# Altium project Capstone_Signal_Conditioners.PrjPcb
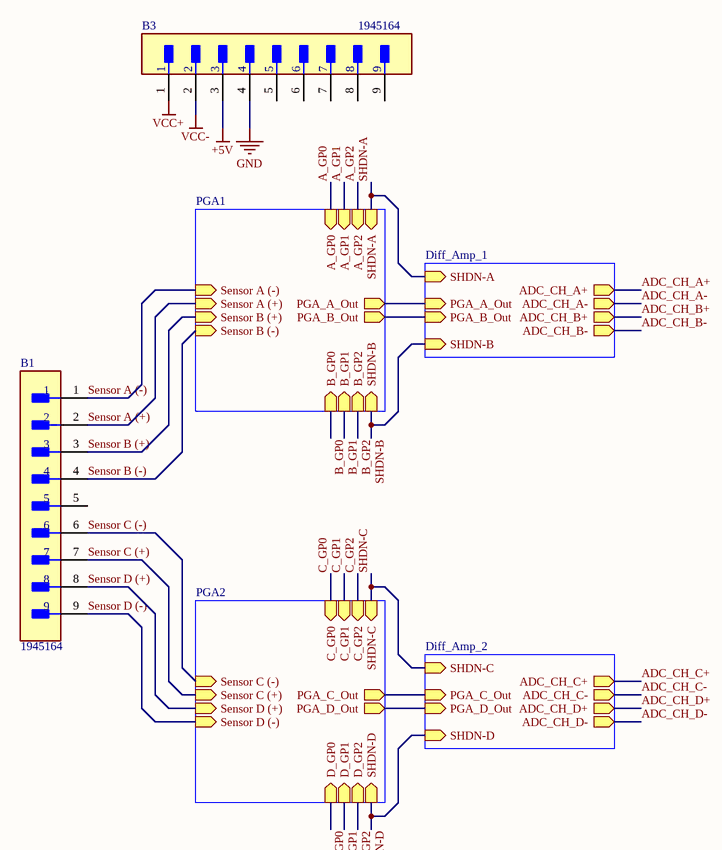
[diagram p0: Capstone_Signal_Conditioners_Subsystem_Test_Schematic.SchDoc]
4 sheets, 44 parts. Net scope: hierarchical (ports join the sheet entries above them; power ports are global).
Board file: Capstone_Signal_Conditioning_Subsystem_Test_PCB.PcbDoc
Sheets:
  Capstone_Signal_Conditioners_Subsystem_Test_Schematic.SchDoc
    PGA1 = THS7002CPWP_Schematic.SchDoc
    PGA2 = THS7002CPWP_Schematic_2.SchDoc
    Diff_Amp_2 = LTC6362_Schematic_2.SchDoc

## Sheet Capstone_Signal_Conditioners_Subsystem_Test_Schematic.SchDoc
size A; SheetNumber: 1; SheetTotal: 5

### Parts
B1  1945164  [FP-4-644456-0-MFG]
B3  1945164  [FP-4-644456-0-MFG]

### Sub-sheets
Diff_Amp_1 = LTC6362_Schematic.SchDoc (file not in this document): PGA_A_Out (in), PGA_B_Out (in), SHDN-A (in), SHDN-B (in), ADC_CH_A+ (out), ADC_CH_A- (out), ADC_CH_B- (out), ADC_CH_B+ (out)
Diff_Amp_2 = LTC6362_Schematic_2.SchDoc: SHDN-C (in), SHDN-D (in), ADC_CH_D- (out), ADC_CH_D+ (out), ADC_CH_C- (out), ADC_CH_C+ (out), PGA_C_Out (in), PGA_D_Out (in)
PGA1 = THS7002CPWP_Schematic.SchDoc: Sensor A (+) (in), Sensor A (-) (in), Sensor B (+) (in), Sensor B (-) (in), A_GP0 (in), A_GP1 (in), A_GP2 (in), PGA_A_Out (out), PGA_B_Out (out), B_GP0 (in), B_GP1 (in), B_GP2 (in), SHDN-A (in), SHDN-B (in)
PGA2 = THS7002CPWP_Schematic_2.SchDoc: Sensor C (+) (in), Sensor C (-) (in), Sensor D (+) (in), Sensor D (-) (in), C_GP0 (in), D_GP0 (in), C_GP1 (in), C_GP2 (in), D_GP1 (in), D_GP2 (in), SHDN-C (in), SHDN-D (in), PGA_C_Out (out), PGA_D_Out (out)

### Nets
+5V: B3.3
GND: B3.4
VCC+: B3.1
VCC-: B3.2
ADC_CH_A+: sheet Diff_Amp_1/ADC_CH_A+
ADC_CH_A-: sheet Diff_Amp_1/ADC_CH_A-
ADC_CH_B+: sheet Diff_Amp_1/ADC_CH_B+
ADC_CH_B-: sheet Diff_Amp_1/ADC_CH_B-
PGA_A_Out: sheet PGA1/PGA_A_Out, sheet Diff_Amp_1/PGA_A_Out
PGA_B_Out: sheet PGA1/PGA_B_Out, sheet Diff_Amp_1/PGA_B_Out
PGA_C_Out: sheet PGA2/PGA_C_Out, sheet Diff_Amp_2/PGA_C_Out
PGA_D_Out: sheet PGA2/PGA_D_Out, sheet Diff_Amp_2/PGA_D_Out
Sensor A (+): B1.2 ; sheet PGA1/Sensor A (+)
Sensor A (-): B1.1 ; sheet PGA1/Sensor A (-)
Sensor B (+): B1.3 ; sheet PGA1/Sensor B (+)
Sensor B (-): B1.4 ; sheet PGA1/Sensor B (-)
Sensor C (+): B1.7 ; sheet PGA2/Sensor C (+)
Sensor C (-): B1.6 ; sheet PGA2/Sensor C (-)
Sensor D (+): B1.8 ; sheet PGA2/Sensor D (+)
Sensor D (-): B1.9 ; sheet PGA2/Sensor D (-)
SHDN-A: sheet PGA1/SHDN-A, sheet Diff_Amp_1/SHDN-A
SHDN-B: sheet PGA1/SHDN-B, sheet Diff_Amp_1/SHDN-B
SHDN-C: sheet PGA2/SHDN-C, sheet Diff_Amp_2/SHDN-C
SHDN-D: sheet PGA2/SHDN-D, sheet Diff_Amp_2/SHDN-D

Not connected (* = marked no-connect by the designer): B1 5; B3 5 6 7 8 9

### Library data of the parts
B1 B3 = CMP-03369-000038-1: CONN HEADER VERT 9POS 3.5MM; Manufacturer Part Number: 4-644456-0; Manufacturer: TE Connectivity; Pitch: 2.54mm; Current Rating: 5A; Conn Gender: Male; Number Of Contacts: 10; Conn Orientation: Vertical; Voltage Rating: 250V; Number Of Rows: 1; Device Class L3: unset; Octopart: https://octopart.com/4-644456-0-te+connectivity-39514173; Mouser Description: Headers & Wire Housings NARROW FLT HDR 10P Straight Post; ComponentLink2Description: Datasheet; Height: 0.408inch; Package: 4-644456-0; RoHS: TRUE; Temperature Range High: +105°C; Digikey Description: CONN HEADER VERT 10POS 2.54MM; Temperature: -55°C to +105°C; Device Class L2: Headers and Wire Housings; Automotive: No; Lead Free: Yes; Contact Material: Tin; Temperature Range Low: -55°C; Footprint Url: https://www.te.com/commerce/DocumentDelivery/DDEController?Action=showdoc&DocId=Customer+Drawing%7F644456%7FD2%7Fpdf%7FEnglish%7FENG_CD_644456_D2.pdf%7F4-644456-0; Device Class L1: Connectors; Category: Conn; ComponentLink2URL: https://www.te.com/commerce/DocumentDelivery/DDEController?Action=showdoc&DocId=Data+Sheet%7F82056_MTA%7F0818%7Fpdf%7FEnglish%7FENG_DS_82056_MTA_0818.pdf%7F4-644456-0

## Sheet THS7002CPWP_Schematic.SchDoc
size A; SheetNumber: 2; SheetTotal: 4
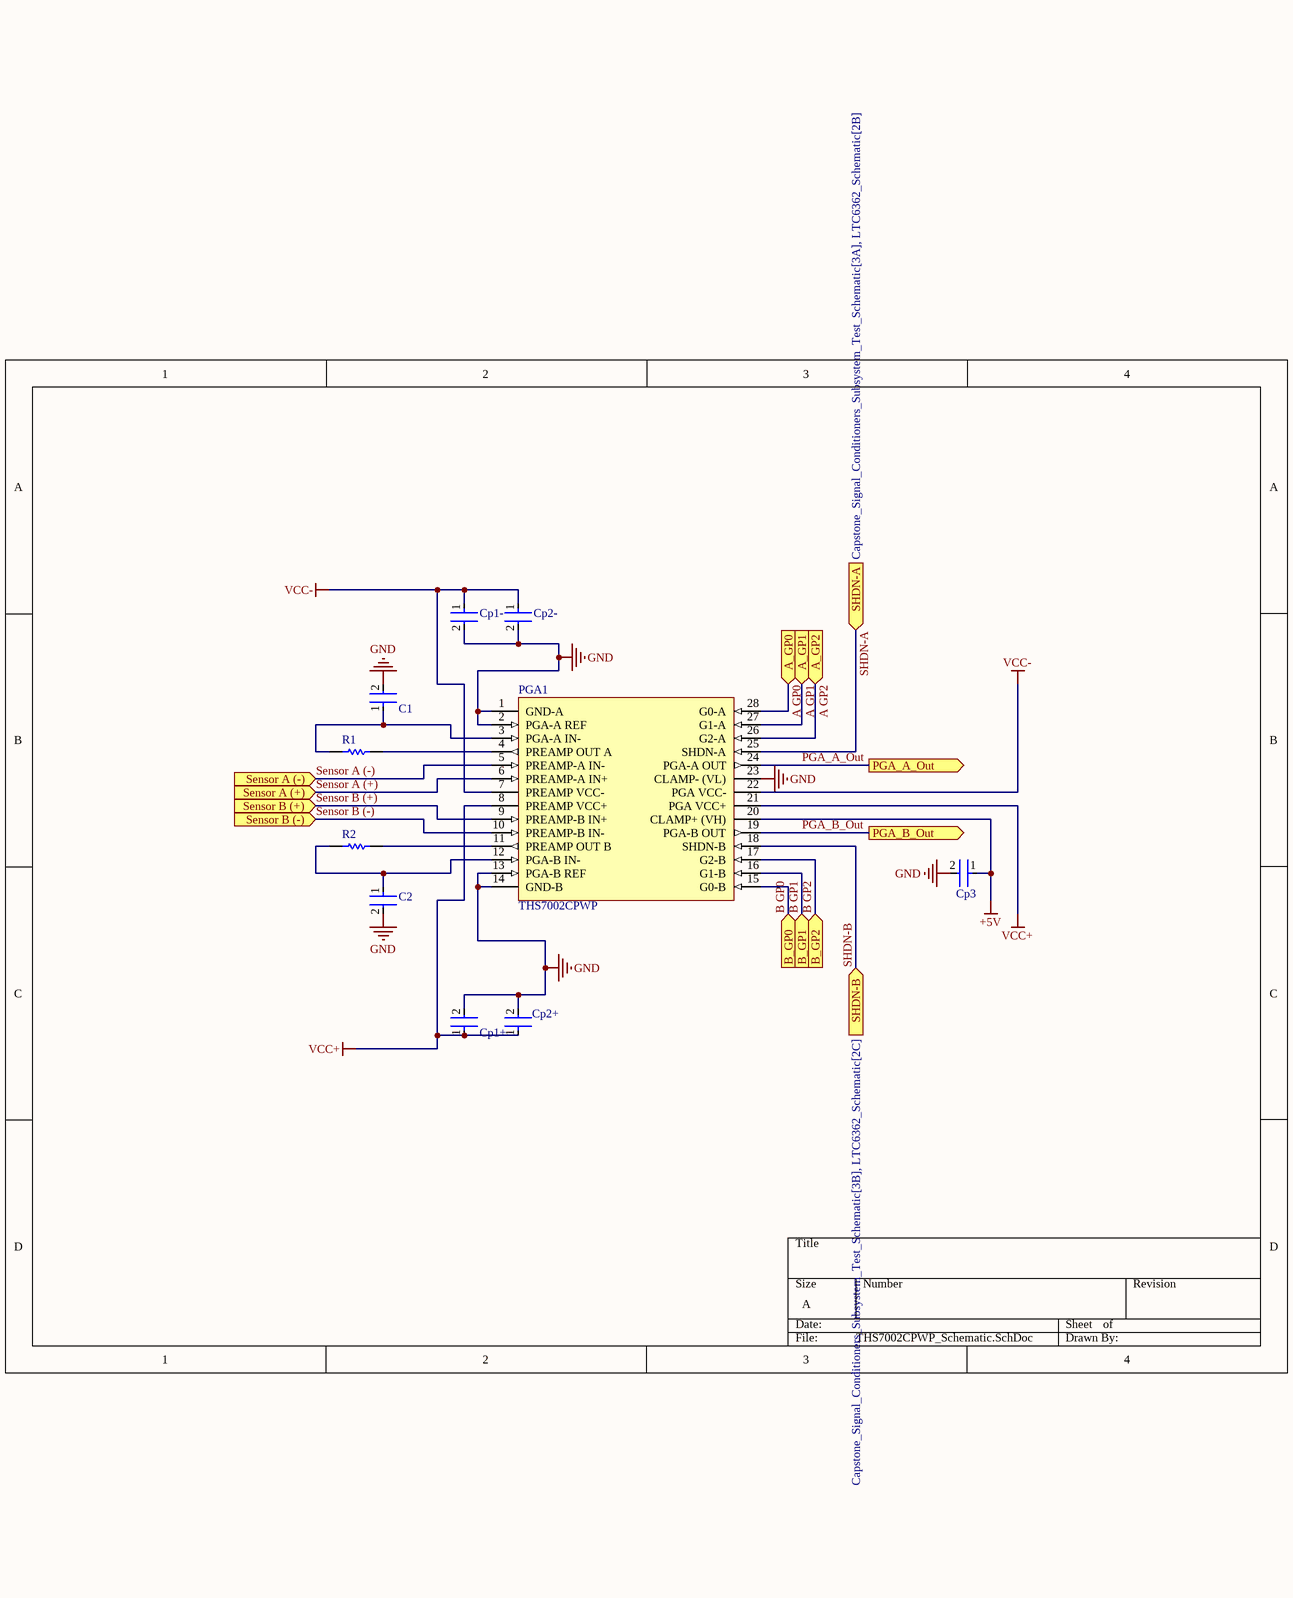
[diagram p1: THS7002CPWP_Schematic.SchDoc]

### Parts
C1  GRM3195C1H163JA01D  [FP-GRM319-0_15-IPC_A]  (value not drawn)
C2  GRM3195C1H163JA01D  [FP-GRM319-0_15-IPC_A]  (value not drawn)
Cp1+  CC0603KRX7R7BB104  [FP-CC0603-DA-MFG]  (value not drawn)
Cp1-  CC0603KRX7R7BB104  [FP-CC0603-DA-MFG]  (value not drawn)
Cp2+  C2012JB1A685K060AC  [FP-C2012-060-0_2-IPC_A]  (value not drawn)
Cp2-  C2012JB1A685K060AC  [FP-C2012-060-0_2-IPC_A]  (value not drawn)
Cp3  C2012JB1A685K060AC  [FP-C2012-060-0_2-IPC_A]  (value not drawn)
PGA1  THS7002CPWP  [PWP0028E_M]
R1  CRCW08050000Z0EA  [RESC2013X50X30LL20T20]  (value not drawn)
R2  CRCW08050000Z0EA  [RESC2013X50X30LL20T20]  (value not drawn)

### Ports
A_GP0 (in, see Capstone_Signal_Conditioners_Subsystem_Test_Schematic[2A]), A_GP1 (in, see Capstone_Signal_Conditioners_Subsystem_Test_Schematic[2A]), A_GP2 (in, see Capstone_Signal_Conditioners_Subsystem_Test_Schematic[3A]), B_GP0 (in, see Capstone_Signal_Conditioners_Subsystem_Test_Schematic[2B]), B_GP1 (in, see Capstone_Signal_Conditioners_Subsystem_Test_Schematic[2B]), B_GP2 (in, see Capstone_Signal_Conditioners_Subsystem_Test_Schematic[3B]), PGA_A_Out (out, see Capstone_Signal_Conditioners_Subsystem_Test_Schematic[3B], LTC6362_Schematic[1B]), PGA_B_Out (out, see Capstone_Signal_Conditioners_Subsystem_Test_Schematic[3B], LTC6362_Schematic[1B]), Sensor A (+) (in, see Capstone_Signal_Conditioners_Subsystem_Test_Schematic[2B]), Sensor A (-) (in, see Capstone_Signal_Conditioners_Subsystem_Test_Schematic[2B]), Sensor B (+) (in, see Capstone_Signal_Conditioners_Subsystem_Test_Schematic[2B]), Sensor B (-) (in, see Capstone_Signal_Conditioners_Subsystem_Test_Schematic[2B]), SHDN-A (in, see Capstone_Signal_Conditioners_Subsystem_Test_Schematic[3A], LTC6362_Schematic[2B]), SHDN-B (in, see Capstone_Signal_Conditioners_Subsystem_Test_Schematic[3B], LTC6362_Schematic[2C])

### Nets
+5V: Cp3.1 PGA1.20(CLAMP+_(VH))
GND: C1.2 C2.2 Cp1+.2 Cp1-.2 Cp2+.2 Cp2-.2 Cp3.2 PGA1.1(GND-A) PGA1.2(PGA-A_REF) PGA1.13(PGA-B_REF) PGA1.14(GND-B) PGA1.23(CLAMP-_(VL))
VCC+: Cp1+.1 Cp2+.1 PGA1.8(PREAMP_VCC+) PGA1.21(PGA_VCC+)
VCC-: Cp1-.1 Cp2-.1 PGA1.7(PREAMP_VCC-) PGA1.22(PGA_VCC-)
A GP0: PGA1.28(G0-A) ; port A_GP0
A GP1: PGA1.27(G1-A) ; port A_GP1
A GP2: PGA1.26(G2-A) ; port A_GP2
B GP0: PGA1.15(G0-B) ; port B_GP0
B GP1: PGA1.16(G1-B) ; port B_GP1
B GP2: PGA1.17(G2-B) ; port B_GP2
PGA_A_Out: PGA1.24(PGA-A_OUT) ; port PGA_A_Out
PGA_B_Out: PGA1.19(PGA-B_OUT) ; port PGA_B_Out
Sensor A (+): PGA1.6(PREAMP-A_IN+) ; port Sensor A (+)
Sensor A (-): PGA1.5(PREAMP-A_IN-) ; port Sensor A (-)
Sensor B (+): PGA1.9(PREAMP-B_IN+) ; port Sensor B (+)
Sensor B (-): PGA1.10(PREAMP-B_IN-) ; port Sensor B (-)
SHDN-A: PGA1.25(SHDN-A) ; port SHDN-A
SHDN-B: PGA1.18(SHDN-B) ; port SHDN-B
NetC1_1: C1.1 PGA1.3(PGA-A_IN-) R1.1
NetC2_1: C2.1 PGA1.12(PGA-B_IN-) R2.1
NetPGA1_4: PGA1.4(PREAMP_OUT_A) R1.2
NetPGA1_11: PGA1.11(PREAMP_OUT_B) R2.2

### Library data of the parts
C1 C2 = CMP-06035-007665-1: Chip Multilayer Ceramic Capacitors for General Purpose, 1206, 16000pF, C0G, 30ppm/°C, 5%, 50V; Capacitance: 16nF; Tolerance: 5%; Case Code (Metric): 3216; Length: 3.2mm; Package Quantity: 4000; Mount: Surface Mount; Voltage Rating (DC): 50V; Voltage Rating: 50V; Case Code (Imperial): 1206; Height: 0.85mm; Min Operating Temperature: -55°C; Max Operating Temperature: 125°C; Termination: SMD/SMT; Width: 0.063inch; Radiation Hardening: No; Depth: 1.6mm; Thickness: 0.037inch; Dielectric: C0G; Case/Package: 1206; Packaging: Tape and Reel
Cp1+ Cp1- = CMP-2000-05002-2: CAP CER 0.1UF 16V X7R 0603; Manufacturer: YAGEO; Tolerance: 0.1; Value: 100 nF; Temperature Coefficient: 15%; Description: CC0603 100 nF X7R 10.00% 16 V; Voltage Rating: 16 V; Package: CC0603-DA; ComponentLink2Description: Datasheet; Octopart: https://octopart.com/cc0603krx7r7bb104-yageo-192941; Temperature Range High: +125°C; Digikey Description: CAP CER 0.1UF 16V X7R 0603; Voltage: 16 V; Device Class L2: Capacitors; Height: 0.9mm; Temperature: -55°C to +125°C; Manufacturer Part Number: CC0603KRX7R7BB104; Device Class L1: Passive Components; Device Class L3: Ceramic Capacitors; ComponentLink2URL: http://www.yageo.com/documents/recent/UPY-GPHC_X7R_6.3V-to-50V_18.pdf; Footprint Url: http://www.yageo.com/exep/pages/download/literatures/UPY-C_GEN_24.pdf; RoHS: TRUE; Temperature Range Low: -55°C; Temperature Characteristic: X7R; Lead Free: Yes; Capacitance: 100 nF; Category: Cap; Mouser Description: Multilayer Ceramic Capacitor, CC Series, 0.1 - F, - 10%, X7R, 16 V, 0603 [1608 Metric]; Material: Ceramic; Automotive: No
Cp2+ Cp2- Cp3 = CMP-08246-004641-1: Multilayer Ceramic Capacitors 6.8μF ±10% 10V JB SMD 0805; Capacitance: 6.8uF; RoHS Compliant: Yes; Case Code (Metric): 5032; Case/Package: 0805; Voltage Rating: 10V; Width: 0.049inch; Min Operating Temperature: -25°C; Mount: Surface Mount; Voltage Rating (DC): 10V; Dielectric Material: Ceramic; Case Code (Imperial): 2012; Package Quantity: 4000; Lead Free: Lead Free; Packaging: Tape and Reel; Length: 0.079inch; Tolerance: 10%; Thickness: 0.028inch; Max Operating Temperature: 85°C; Series: C
PGA1 = CMP-0988-00132-2: 70-MHz High-Speed Programmable-Gain Amplifier, Dual, 0 to 70 degC, 28-pin SOP (PWP28), Green (RoHS & no Sb/Br); Manufacturer: Texas Instruments; Disable: TRUE; BW @ Acl(MHz): 100; Vs(Min)(V): 9; Vs(Max)(V): 32; Number of Channels: 2; Vio(Max)(mV): 7; Iib(Max)(nA): 6000; SubFamily: Variable Gain Amplifier; Vn at Flatband(Typ)(nV/rtHz): 1.7; Slew Rate(Typ)(V/us): 85; ComponentLink1Description: Manufacturer URL; Code_JEDEC: MO-153; PackageVersion: 4073225-6/I, 05/2011; PackageReference: PWP0028E; Eco-Plan: Green (RoHS & no Sb/Br); ComponentLink2URL: http://www.ti.com/general/docs/lit/getliterature.tsp?genericPartNumber=THS7002&fileType=pdf; PackageDescription: 28-Pin Plastic Small Outline, Body 4.4 x 9.7 mm, Pitch 0.65 mm; DatasheetVersion: SLOS214C; ComponentLink3URL: http://www.ti.com/litv/pdf/mpds373; ComponentLink3Description: Package Specification; ComponentLink1URL: http://www.ti.com/; ComponentLink2Description: Datasheet; Mounting Technology: Surface Mount; PartNumber: THS7002CPWP
R1 R2 = CMP-2001-04896-1: Manufacturer: Vishay Dale; Part Number: CRCW08050000Z0EA

## Sheet THS7002CPWP_Schematic_2.SchDoc
size A; SheetNumber: 4; SheetTotal: 4
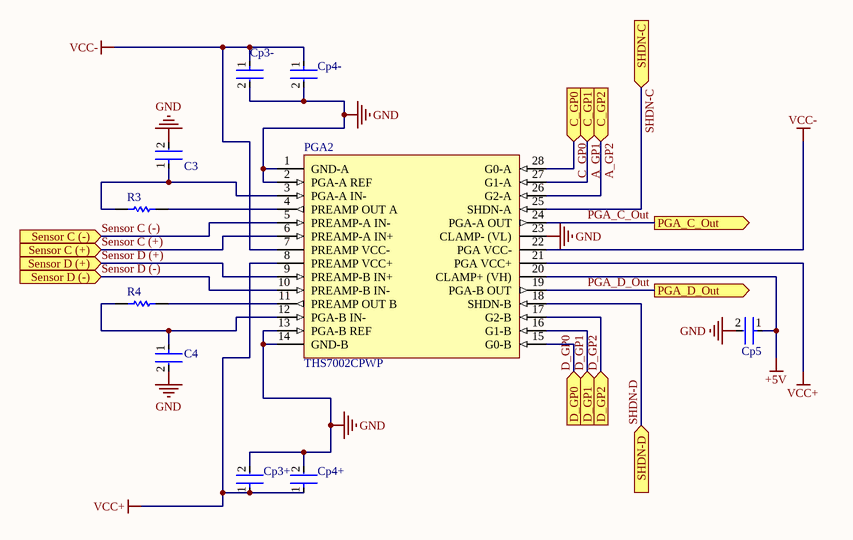
[diagram p2: THS7002CPWP_Schematic_2.SchDoc]

### Parts
C3  GRM3195C1H163JA01D  [FP-GRM319-0_15-IPC_A]  (value not drawn)
C4  GRM3195C1H163JA01D  [FP-GRM319-0_15-IPC_A]  (value not drawn)
Cp3+  CC0603KRX7R7BB104  [FP-CC0603-DA-MFG]  (value not drawn)
Cp3-  CC0603KRX7R7BB104  [FP-CC0603-DA-MFG]  (value not drawn)
Cp4+  C2012JB1A685K060AC  [FP-C2012-060-0_2-IPC_A]  (value not drawn)
Cp4-  C2012JB1A685K060AC  [FP-C2012-060-0_2-IPC_A]  (value not drawn)
Cp5  C2012JB1A685K060AC  [FP-C2012-060-0_2-IPC_A]  (value not drawn)
PGA2  THS7002CPWP  [PWP0028E_M]
R3  CRCW08050000Z0EA  [RESC2013X50X30LL20T20]  (value not drawn)
R4  CRCW08050000Z0EA  [RESC2013X50X30LL20T20]  (value not drawn)

### Ports
C_GP0 (in, see Capstone_Signal_Conditioners_Subsystem_Test_Schematic[2A]), C_GP1 (in, see Capstone_Signal_Conditioners_Subsystem_Test_Schematic[2A]), C_GP2 (in, see Capstone_Signal_Conditioners_Subsystem_Test_Schematic[3A]), D_GP0 (in, see Capstone_Signal_Conditioners_Subsystem_Test_Schematic[2B]), D_GP1 (in, see Capstone_Signal_Conditioners_Subsystem_Test_Schematic[2B]), D_GP2 (in, see Capstone_Signal_Conditioners_Subsystem_Test_Schematic[3B]), PGA_C_Out (out, see Capstone_Signal_Conditioners_Subsystem_Test_Schematic[3B], LTC6362_Schematic[1B]), PGA_D_Out (out, see Capstone_Signal_Conditioners_Subsystem_Test_Schematic[3B], LTC6362_Schematic[1B]), Sensor C (+) (in, see Capstone_Signal_Conditioners_Subsystem_Test_Schematic[2B]), Sensor C (-) (in, see Capstone_Signal_Conditioners_Subsystem_Test_Schematic[2B]), Sensor D (+) (in, see Capstone_Signal_Conditioners_Subsystem_Test_Schematic[2B]), Sensor D (-) (in, see Capstone_Signal_Conditioners_Subsystem_Test_Schematic[2B]), SHDN-C (in, see Capstone_Signal_Conditioners_Subsystem_Test_Schematic[3A]), SHDN-D (in, see Capstone_Signal_Conditioners_Subsystem_Test_Schematic[3B], LTC6362_Schematic[2C])

### Nets
+5V: Cp5.1 PGA2.20(CLAMP+_(VH))
GND: C3.2 C4.2 Cp3+.2 Cp3-.2 Cp4+.2 Cp4-.2 Cp5.2 PGA2.1(GND-A) PGA2.2(PGA-A_REF) PGA2.13(PGA-B_REF) PGA2.14(GND-B) PGA2.23(CLAMP-_(VL))
VCC+: Cp3+.1 Cp4+.1 PGA2.8(PREAMP_VCC+) PGA2.21(PGA_VCC+)
VCC-: Cp3-.1 Cp4-.1 PGA2.7(PREAMP_VCC-) PGA2.22(PGA_VCC-)
A_GP1: PGA2.27(G1-A) ; port C_GP1
A_GP2: PGA2.26(G2-A) ; port C_GP2
C_GP0: PGA2.28(G0-A) ; port C_GP0
D_GP0: PGA2.15(G0-B) ; port D_GP0
D_GP1: PGA2.16(G1-B) ; port D_GP1
D_GP2: PGA2.17(G2-B) ; port D_GP2
PGA_C_Out: PGA2.24(PGA-A_OUT) ; port PGA_C_Out
PGA_D_Out: PGA2.19(PGA-B_OUT) ; port PGA_D_Out
Sensor C (+): PGA2.6(PREAMP-A_IN+) ; port Sensor C (+)
Sensor C (-): PGA2.5(PREAMP-A_IN-) ; port Sensor C (-)
Sensor D (+): PGA2.9(PREAMP-B_IN+) ; port Sensor D (+)
Sensor D (-): PGA2.10(PREAMP-B_IN-) ; port Sensor D (-)
SHDN-C: PGA2.25(SHDN-A) ; port SHDN-C
SHDN-D: PGA2.18(SHDN-B) ; port SHDN-D
NetC3_1: C3.1 PGA2.3(PGA-A_IN-) R3.1
NetC4_1: C4.1 PGA2.12(PGA-B_IN-) R4.1
NetPGA2_4: PGA2.4(PREAMP_OUT_A) R3.2
NetPGA2_11: PGA2.11(PREAMP_OUT_B) R4.2

### Library data of the parts
C3 C4 = CMP-06035-007665-1: as C1 on sheet THS7002CPWP_Schematic; Tolerance: 5%; Case Code (Metric): 3216; Length: 3.2mm; Package Quantity: 4000; Mount: Surface Mount; Voltage Rating (DC): 50V; Voltage Rating: 50V; Case Code (Imperial): 1206; Height: 0.85mm; Min Operating Temperature: -55°C; Max Operating Temperature: 125°C; Termination: SMD/SMT; Width: 0.063inch; Radiation Hardening: No; Depth: 1.6mm; Thickness: 0.037inch; Dielectric: C0G; Case/Package: 1206; Packaging: Tape and Reel
Cp3+ Cp3- = CMP-2000-05002-2: as Cp1+ on sheet THS7002CPWP_Schematic; Voltage Rating: 16 V; Package: CC0603-DA; ComponentLink2Description: Datasheet; Octopart: https://octopart.com/cc0603krx7r7bb104-yageo-192941; Temperature Range High: +125°C; Digikey Description: CAP CER 0.1UF 16V X7R 0603; Voltage: 16 V; Device Class L2: Capacitors; Height: 0.9mm; Temperature: -55°C to +125°C; Manufacturer Part Number: CC0603KRX7R7BB104; Device Class L1: Passive Components; Device Class L3: Ceramic Capacitors; ComponentLink2URL: http://www.yageo.com/documents/recent/UPY-GPHC_X7R_6.3V-to-50V_18.pdf; Footprint Url: http://www.yageo.com/exep/pages/download/literatures/UPY-C_GEN_24.pdf; RoHS: TRUE; Temperature Range Low: -55°C; Temperature Characteristic: X7R; Lead Free: Yes; Capacitance: 100 nF; Category: Cap; Mouser Description: Multilayer Ceramic Capacitor, CC Series, 0.1 - F, - 10%, X7R, 16 V, 0603 [1608 Metric]; Material: Ceramic; Automotive: No
Cp4+ Cp4- Cp5 = CMP-08246-004641-1: as Cp2+ on sheet THS7002CPWP_Schematic; RoHS Compliant: Yes; Case Code (Metric): 5032; Case/Package: 0805; Voltage Rating: 10V; Width: 0.049inch; Min Operating Temperature: -25°C; Mount: Surface Mount; Voltage Rating (DC): 10V; Dielectric Material: Ceramic; Case Code (Imperial): 2012; Package Quantity: 4000; Lead Free: Lead Free; Packaging: Tape and Reel; Length: 0.079inch; Tolerance: 10%; Thickness: 0.028inch; Max Operating Temperature: 85°C; Series: C
PGA2 = CMP-0988-00132-2: as PGA1 on sheet THS7002CPWP_Schematic; ComponentLink1Description: Manufacturer URL; Code_JEDEC: MO-153; PackageVersion: 4073225-6/I, 05/2011; PackageReference: PWP0028E; Eco-Plan: Green (RoHS & no Sb/Br); ComponentLink2URL: http://www.ti.com/general/docs/lit/getliterature.tsp?genericPartNumber=THS7002&fileType=pdf; PackageDescription: 28-Pin Plastic Small Outline, Body 4.4 x 9.7 mm, Pitch 0.65 mm; DatasheetVersion: SLOS214C; ComponentLink3URL: http://www.ti.com/litv/pdf/mpds373; ComponentLink3Description: Package Specification; ComponentLink1URL: http://www.ti.com/; ComponentLink2Description: Datasheet; Mounting Technology: Surface Mount; PartNumber: THS7002CPWP
R3 R4 = CMP-2001-04896-1: Manufacturer: Vishay Dale; Part Number: CRCW08050000Z0EA

## Sheet LTC6362_Schematic_2.SchDoc
size A; SheetNumber: 16; SheetTotal: 16
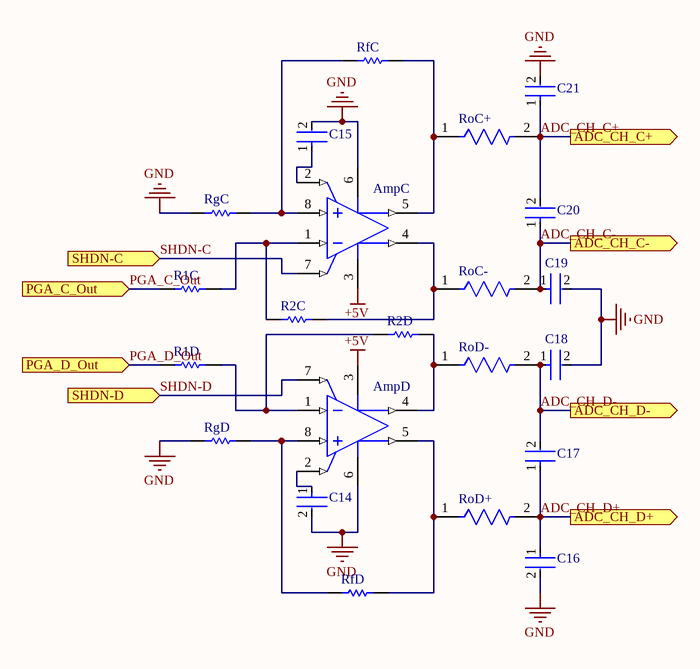
[diagram p3: LTC6362_Schematic_2.SchDoc]

### Parts
AmpC  LTC6362HMS8#PBF  [LT-MS8-8_L]  (value not drawn)
AmpD  LTC6362HMS8#PBF  [LT-MS8-8_L]  (value not drawn)
C14  GQM1875C2ER10BB12D  [FP-GQM187-0_15-MFG]  (value not drawn)
C15  GQM1875C2ER10BB12D  [FP-GQM187-0_15-MFG]  (value not drawn)
C16  CC0603KRX7R9BB392  [FP-CC0603-DA-MFG]  (value not drawn)
C17  CC0603KRX7R9BB392  [FP-CC0603-DA-MFG]  (value not drawn)
C18  CC0603KRX7R9BB392  [FP-CC0603-DA-MFG]  (value not drawn)
C19  CC0603KRX7R9BB392  [FP-CC0603-DA-MFG]  (value not drawn)
C20  CC0603KRX7R9BB392  [FP-CC0603-DA-MFG]  (value not drawn)
C21  CC0603KRX7R9BB392  [FP-CC0603-DA-MFG]  (value not drawn)
R1C  ERJ-6ENF1241V  [RESC2013X70X40LL20T20]  (value not drawn)
R1D  ERJ-6ENF1241V  [RESC2013X70X40LL20T20]  (value not drawn)
R2C  RC0805FR-071KL  [RESC2013X60X35ML10T20]  (value not drawn)
R2D  RC0805FR-071KL  [RESC2013X60X35ML10T20]  (value not drawn)
RfC  RC0805FR-071KL  [RESC2013X60X35ML10T20]  (value not drawn)
RfD  RC0805FR-071KL  [RESC2013X60X35ML10T20]  (value not drawn)
RgC  ERJ-6ENF1241V  [RESC2013X70X40LL20T20]  (value not drawn)
RgD  ERJ-6ENF1241V  [RESC2013X70X40LL20T20]  (value not drawn)
RoC+  CRCW060335K7FKEA  [FP-CRCW0603-e3-IPC_C]  (value not drawn)
RoC-  CRCW060335K7FKEA  [FP-CRCW0603-e3-IPC_C]  (value not drawn)
RoD+  CRCW060335K7FKEA  [FP-CRCW0603-e3-IPC_C]  (value not drawn)
RoD-  CRCW060335K7FKEA  [FP-CRCW0603-e3-IPC_C]  (value not drawn)

### Ports
ADC_CH_C+ (out), ADC_CH_C- (out), ADC_CH_D+ (out), ADC_CH_D- (out), PGA_C_Out (in), PGA_D_Out (in), SHDN-C (in), SHDN-D (in)

### Nets
+5V: AmpC.3(V+) AmpD.3(V+)
GND: AmpC.6(V-) AmpD.6(V-) C14.2 C15.2 C16.2 C18.2 C19.2 C21.2 RgC.1 RgD.1
ADC_CH_C+: C20.2 C21.1 RoC+.2 ; port ADC_CH_C+
ADC_CH_C-: C19.1 C20.1 RoC-.2 ; port ADC_CH_C-
ADC_CH_D+: C16.1 C17.1 RoD+.2 ; port ADC_CH_D+
ADC_CH_D-: C17.2 C18.1 RoD-.2 ; port ADC_CH_D-
PGA_C_Out: R1C.1 ; port PGA_C_Out
PGA_D_Out: R1D.1 ; port PGA_D_Out
SHDN-C: AmpC.7(~{SHDN}) ; port SHDN-C
SHDN-D: AmpD.7(~{SHDN}) ; port SHDN-D
NetAmpC_1: AmpC.1(-IN) R1C.2 R2C.1
NetAmpC_2: AmpC.2(VOCM) C15.1
NetAmpC_4: AmpC.4(+OUT) R2C.2 RoC-.1
NetAmpC_5: AmpC.5(-OUT) RfC.2 RoC+.1
NetAmpC_8: AmpC.8(+IN) RfC.1 RgC.2
NetAmpD_1: AmpD.1(-IN) R1D.2 R2D.1
NetAmpD_2: AmpD.2(VOCM) C14.1
NetAmpD_4: AmpD.4(+OUT) R2D.2 RoD-.1
NetAmpD_5: AmpD.5(-OUT) RfD.2 RoD+.1
NetAmpD_8: AmpD.8(+IN) RfD.1 RgD.2

### Library data of the parts
AmpC AmpD = CMP-0359-00920-2: Single Channel, Precision, Low Power Differential Operational Amplifier / SAR ADC Driver, RRIO, 180 MHz Typical GBW, 45 V/us Typical SR, 2.8 to 5.25 V, 8-Pin SOP (MS8-8), High Temperature / Automotive, Pb-Free; Manufacturer: Linear Technology; Vs Max (V): 5.25; Is (mA) Typical: 0.9; SR (V/us) Typical: 45; Channels (#): 1; GBW (MHz) Typical: 180; Vos (mV) Typical: 0.05; Vs Min (V): 2.8; PartNumber: LTC6362HMS8#PBF; PackageDescription: 8-Lead Plastic Small Outline, Body 3.9 x 4.9 mm, Pitch 1.27 mm; ComponentLink2Description: Datasheet; ComponentLink3URL: http://cds.linear.com/docs/en/packaging/05081610_G_SO8.pdf; ComponentLink1Description: Manufacturer URL; PackageReference: LT-MS8-8; ComponentLink2URL: http://cds.linear.com/docs/en/datasheet/6362fa.pdf; PackageVersion: Rev G; Mounting Technology: Surface Mount; Linear Technology Part Number: LTC6362; DatasheetVersion: Rev. A; RevisionNote: URLs updated; RoHS: Pb-Free; ComponentLink1URL: http://www.linear.com/; Type: DIFF; ComponentLink3Description: Package Specification
C14 C15 = CMP-06035-052255-1: Ceramic Capacitor 0.1pF ±0.1pF 250VDC C0G 0603 Paper T/R; Voltage Rating: 250V; Width: 0.031inch; Length: 1.6mm; Max Operating Temperature: 125°C; Min Operating Temperature: -55°C; Height: 0.7mm; Dielectric: C0G; Termination: SMD/SMT; Depth: 0.8mm; Case/Package: 0603; Package Quantity: 4000; Radiation Hardening: No; Case Code (Metric): 1608; Thickness: 0.031inch; Capacitance: 0.1pF; Case Code (Imperial): 0603; Voltage Rating (DC): 250V; Packaging: Tape and Reel; Mount: Surface Mount
C16-C21 = CMP-03422-000635-2: CAP CER 3900PF 50V X7R 0603; Tolerance: 10%; Dielectric Material: Ceramic; Capacitance: 3.9nF; Insulation Resistance: 100GR; Height: 0.8mm; Voltage Rating: 50V; Termination: SMD/SMT; REACH SVHC: No SVHC; Resistor Type: Ceramic; Radiation Hardening: No; Case Code (Imperial): 0603; Voltage: 50V; Series: CC; Mount: Surface Mount; Length: 1.6mm; RoHS Compliant: Yes; Lead Free: Lead Free; Width: 0.8mm; Package Quantity: 4000; Packaging: Tape and Reel; Dielectric: X7R; Voltage Rating (DC): 50V; Min Operating Temperature: -55°C; Depth: 0.8mm; Halogen Free: Halogen Free; Case/Package: 0603; Thickness: 0.035inch; Number of Pins: 2; Max Operating Temperature: 125°C; Case Code (Metric): 1608; Construction: Flat
R1C R1D RgC RgD = CMP-2001-04406-1: Manufacturer: Panasonic; Part Number: ERJ-6ENF1241V
R2C R2D RfC RfD = CMP-2100-03671-1: Chip Resistor, 1 KOhm, +/- 1%, 125 mW, -55 to 155 degC, 0805 (2012 Metric), RoHS, Tape and Reel; Manufacturer: Yageo; Temperature Coefficient: 100ppm/degreesC; Voltage Rating (DC): 150V; Max Power Dissipation: 125mW; Resistance: 1KOhm; Number of Pins: 2; Number of Terminations: 2; Datasheet URL: http://www.yageo.com/NewPortal/yageodocoutput?fileName=/pdf/R-Chip/PYu-RC_Group_51_RoHS_L_5.pdf; Length: 0.079inch; Package Description: 2-Pin Surface Mounted Device, Body 2 x 1.25 mm; Depth: 1.25mm; Height: 0.024inch; Military Standard: Not; Case/Package: 0805; Package Reference: 0805; RoHSCompliant: true; Lead Free: LeadFree; Packaging: TapeandReel; Package Quantity: 1; Datasheet Version: Rev. 5, 10/2016; Tolerance: 1%; Min Operating Temperature: -55degC; Voltage Rating: 150V; Composition: ThickFilm; Case Code (Imperial): 0805; Power Rating: 125mW; Width: 0.049inch; Case Code (Metric): 2012; Manufacturer URL: http://www.yageo.com/; Max Operating Temperature: 155degC; REACH SVHC: Unknown; Termination: SMD/SMT
RoC+ RoC- RoD+ RoD- = CMP-2000-03264-2: RES Thick Film, 35.7kΩ, 1%, 0.1W, 100ppm/°C, 0603; Max Power Dissipation: 100mW; Voltage Rating: 75V; Resistance: 35.7kR; Weight: 7.1E-05oz; Termination: Solder; Max Operating Temperature: 155°C; Military Standard: Not; Height: 0.45mm; Temperature Coefficient: 100ppm/°C; Contact Plating: Tin; Packaging: Tape and Reel; Radiation Hardening: No; Depth: 0.85mm; Number of Pins: 2; Length: 1.55mm; Composition: Thick Film; Case Code (Metric): 1608; Package Quantity: 10; Width: 0.033inch; Number of Terminations: 2; Power Rating: 100mW; Case/Package: 0603; Case Code (Imperial): 0603; Features: Automotive AEC-Q200; Tolerance: 1%; Min Operating Temperature: -55°C

## Nets that join several sheets
+5V: Capstone_Signal_Conditioners_Subsystem_Test_Schematic (B3.3), THS7002CPWP_Schematic (Cp3.1 PGA1.20), THS7002CPWP_Schematic_2 (Cp5.1 PGA2.20), LTC6362_Schematic_2 (AmpC.3 AmpD.3)
GND: Capstone_Signal_Conditioners_Subsystem_Test_Schematic (B3.4), THS7002CPWP_Schematic (12 pins), THS7002CPWP_Schematic_2 (12 pins), LTC6362_Schematic_2 (10 pins)
VCC+: Capstone_Signal_Conditioners_Subsystem_Test_Schematic (B3.1), THS7002CPWP_Schematic (Cp1+.1 Cp2+.1 PGA1.8 PGA1.21), THS7002CPWP_Schematic_2 (Cp3+.1 Cp4+.1 PGA2.8 PGA2.21)
VCC-: Capstone_Signal_Conditioners_Subsystem_Test_Schematic (B3.2), THS7002CPWP_Schematic (Cp1-.1 Cp2-.1 PGA1.7 PGA1.22), THS7002CPWP_Schematic_2 (Cp3-.1 Cp4-.1 PGA2.7 PGA2.22)
PGA_C_Out: THS7002CPWP_Schematic_2 (PGA2.24), LTC6362_Schematic_2 (R1C.1)
PGA_D_Out: THS7002CPWP_Schematic_2 (PGA2.19), LTC6362_Schematic_2 (R1D.1)
Sensor A (+): Capstone_Signal_Conditioners_Subsystem_Test_Schematic (B1.2), THS7002CPWP_Schematic (PGA1.6)
Sensor A (-): Capstone_Signal_Conditioners_Subsystem_Test_Schematic (B1.1), THS7002CPWP_Schematic (PGA1.5)
Sensor B (+): Capstone_Signal_Conditioners_Subsystem_Test_Schematic (B1.3), THS7002CPWP_Schematic (PGA1.9)
Sensor B (-): Capstone_Signal_Conditioners_Subsystem_Test_Schematic (B1.4), THS7002CPWP_Schematic (PGA1.10)
Sensor C (+): Capstone_Signal_Conditioners_Subsystem_Test_Schematic (B1.7), THS7002CPWP_Schematic_2 (PGA2.6)
Sensor C (-): Capstone_Signal_Conditioners_Subsystem_Test_Schematic (B1.6), THS7002CPWP_Schematic_2 (PGA2.5)
Sensor D (+): Capstone_Signal_Conditioners_Subsystem_Test_Schematic (B1.8), THS7002CPWP_Schematic_2 (PGA2.9)
Sensor D (-): Capstone_Signal_Conditioners_Subsystem_Test_Schematic (B1.9), THS7002CPWP_Schematic_2 (PGA2.10)
SHDN-C: THS7002CPWP_Schematic_2 (PGA2.25), LTC6362_Schematic_2 (AmpC.7)
SHDN-D: THS7002CPWP_Schematic_2 (PGA2.18), LTC6362_Schematic_2 (AmpD.7)